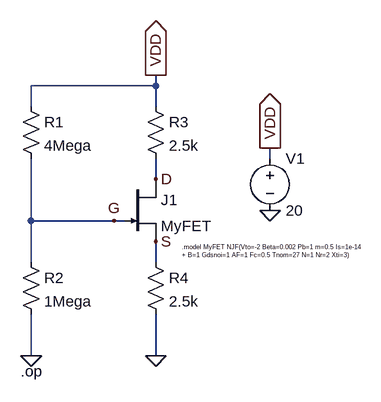
[diagram p0: schematic 007 JFET.asc]
007 JFET.asc, the LTspice schematic file:
Version 4
SHEET 1 2736 680
WIRE 176 -112 176 -128
WIRE 176 -112 -16 -112
WIRE -16 -80 -16 -112
WIRE 176 -80 176 -112
WIRE 352 0 352 -16
WIRE 176 32 176 0
WIRE -16 96 -16 0
WIRE 112 96 -16 96
WIRE 128 96 112 96
WIRE -16 160 -16 96
WIRE 176 160 176 128
WIRE -16 304 -16 240
WIRE 176 304 176 240
FLAG -16 304 0
FLAG 352 80 0
FLAG 176 32 D
FLAG 112 96 G
FLAG 176 304 0
FLAG 352 -16 VDD
IOPIN 352 -16 Out
FLAG 176 -128 VDD
IOPIN 176 -128 Out
FLAG 176 128 S
SYMBOL voltage 352 -16 R0
SYMATTR InstName V1
SYMATTR Value 20
SYMBOL njf 128 32 R0
SYMATTR InstName J1
SYMATTR Value MyFET
SYMBOL res -32 -96 R0
SYMATTR InstName R1
SYMATTR Value 4Mega
SYMBOL res -32 144 R0
SYMATTR InstName R2
SYMATTR Value 1Mega
SYMBOL res 160 -96 R0
SYMATTR InstName R3
SYMATTR Value 2.5k
SYMBOL res 160 144 R0
SYMATTR InstName R4
SYMATTR Value 2.5k
TEXT 216 136 Left 0 !.model MyFET NJF(Vto=-2 Beta=0.002 Pb=1 m=0.5 Is=1e-14\n+ B=1 Gdsnoi=1 AF=1 Fc=0.5 Tnom=27 N=1 Nr=2 Xti=3)
TEXT -32 328 Left 2 !.op

The netlist it stands for:
* 007 JFET.asc
V1 VDD 0 20
J1 D G S MyFET
R1 VDD G 4Mega
R2 G 0 1Mega
R3 VDD D 2.5k
R4 S 0 2.5k
.model NJF NJF
.model PJF PJF
.lib standard.jft
.model MyFET NJF(Vto=-2 Beta=0.002 Pb=1 m=0.5 Is=1e-14
+ B=1 Gdsnoi=1 AF=1 Fc=0.5 Tnom=27 N=1 Nr=2 Xti=3)
.op
.backanno
.end